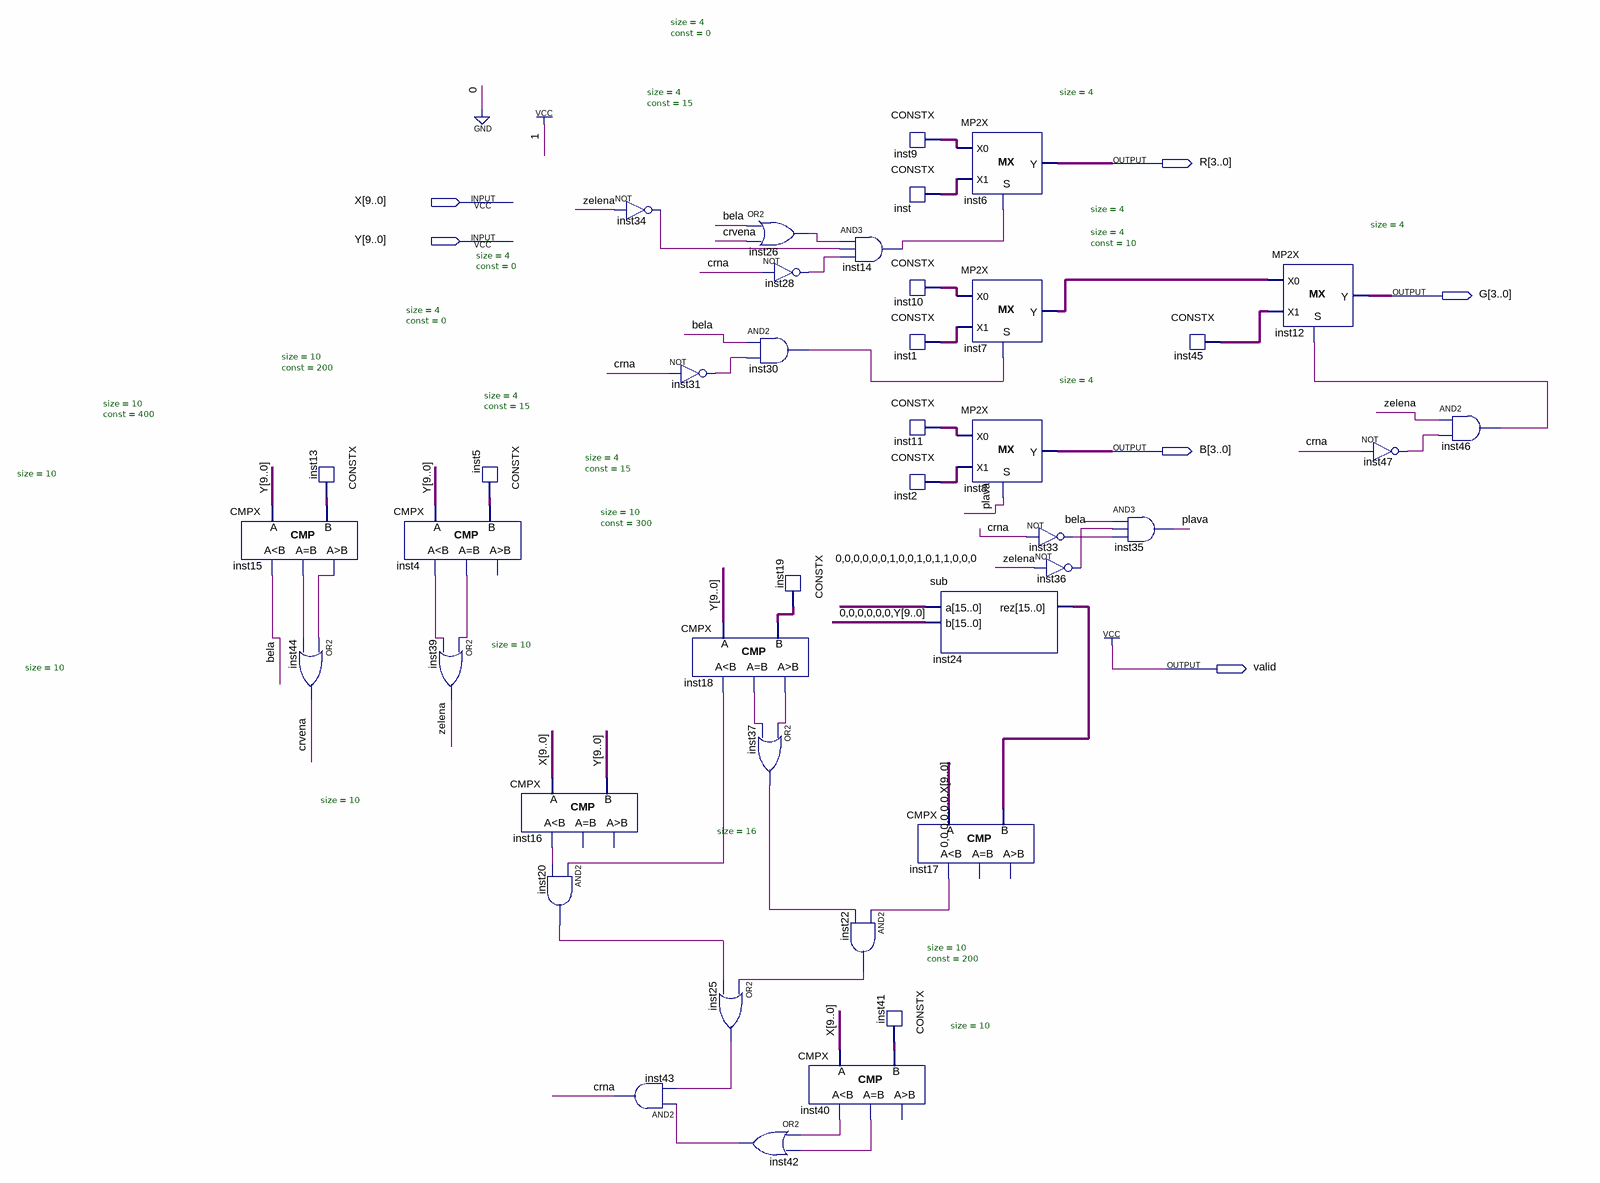
[diagram p0: schematic sheet]
// Quartus schematic Kuvajt.bdf as structural Verilog: 41 symbols, 6 pins
module Kuvajt (
  input  [9:0] X,
  input  [9:0] Y,
  output [3:0] R,
  output [3:0] G,
  output [3:0] B,
  output valid
);

  wire bela, crna, crvena, inst4_eq, inst4_ls, inst14_out, inst15_eq, inst15_gr, inst16_ls, inst17_ls,
       inst18_eq, inst18_gr, inst18_ls, inst20_out, inst22_out, inst25_out, inst26_out, inst28_out,
       inst30_out, inst31_out, inst33_out, inst34_out, inst36_out, inst37_out, inst40_eq, inst40_ls,
       inst42_out, inst46_out, inst47_out, plava, zelena;
  wire [3:0] inst1_data, inst2_data, inst7_y, inst9_data, inst10_data, inst11_data, inst45_data, inst_data;
  wire [9:0] inst5_data, inst13_data, inst19_data, inst41_data;
  wire [15:0] inst24_rez;

  CMPX #(.size(10)) inst15 (.A(Y), .B(inst13_data), .ls(bela), .eq(inst15_eq), .gr(inst15_gr));
  or inst44 (crvena, inst15_gr, inst15_eq);
  CONSTX #(.size(10), .\const (400)) inst13 (.data(inst13_data));
  CMPX #(.size(10)) inst4 (.A(Y), .B(inst5_data), .ls(inst4_ls), .eq(inst4_eq));  // open: gr
  CONSTX #(.size(10), .\const (200)) inst5 (.data(inst5_data));
  or inst39 (zelena, inst4_eq, inst4_ls);
  CMPX #(.size(10)) inst16 (.A(X), .B(Y), .ls(inst16_ls));  // open: eq, gr
  and inst20 (inst20_out, inst18_ls, inst16_ls);
  not inst34 (inst34_out, zelena);
  and inst43 (crna, inst42_out, inst25_out);
  not inst31 (inst31_out, crna);
  CMPX #(.size(10)) inst18 (.A(Y), .B(inst19_data), .ls(inst18_ls), .eq(inst18_eq), .gr(inst18_gr));
  or inst25 (inst25_out, inst22_out, inst20_out);
  or inst26 (inst26_out, bela, crvena);
  not inst28 (inst28_out, crna);
  and inst30 (inst30_out, bela, inst31_out);
  CONSTX #(.size(10), .\const (300)) inst19 (.data(inst19_data));
  or inst37 (inst37_out, inst18_gr, inst18_eq);
  or inst42 (inst42_out, inst40_ls, inst40_eq);
  and inst14 (inst14_out, inst26_out, inst34_out, inst28_out);
  and inst22 (inst22_out, inst17_ls, inst37_out);
  CMPX #(.size(10)) inst40 (.A(X), .B(inst41_data), .ls(inst40_ls), .eq(inst40_eq));  // open: gr
  CONSTX #(.size(4), .\const (0)) inst9 (.data(inst9_data));
  CONSTX #(.size(4), .\const (15)) inst (.data(inst_data));
  CONSTX #(.size(4), .\const (0)) inst10 (.data(inst10_data));
  CONSTX #(.size(4), .\const (15)) inst1 (.data(inst1_data));
  CONSTX #(.size(4), .\const (0)) inst11 (.data(inst11_data));
  CONSTX #(.size(4), .\const (15)) inst2 (.data(inst2_data));
  CMPX #(.size(16)) inst17 (.A({{6{1'b0}}, X}), .B(inst24_rez), .ls(inst17_ls));  // open: eq, gr
  CONSTX #(.size(10), .\const (200)) inst41 (.data(inst41_data));
  MP2X #(.size(4)) inst6 (.S(inst14_out), .X0(inst9_data), .X1(inst_data), .Y(R));
  MP2X #(.size(4)) inst7 (.S(inst30_out), .X0(inst10_data), .X1(inst1_data), .Y(inst7_y));
  MP2X #(.size(4)) inst8 (.S(plava), .X0(inst11_data), .X1(inst2_data), .Y(B));
  sub inst24 (.a(16'b0000001001011000), .b({{6{1'b0}}, Y}), .rez(inst24_rez));
  not inst33 (inst33_out, crna);
  not inst36 (inst36_out, zelena);
  and inst35 (plava, bela, inst36_out, inst33_out);
  CONSTX #(.size(4), .\const (10)) inst45 (.data(inst45_data));
  MP2X #(.size(4)) inst12 (.S(inst46_out), .X0(inst7_y), .X1(inst45_data), .Y(G));
  not inst47 (inst47_out, crna);
  and inst46 (inst46_out, zelena, inst47_out);

  assign valid = 1'b1;
endmodule
